# EAGLE schematic ESP-01_Slim (EAGLE 9.6.2)
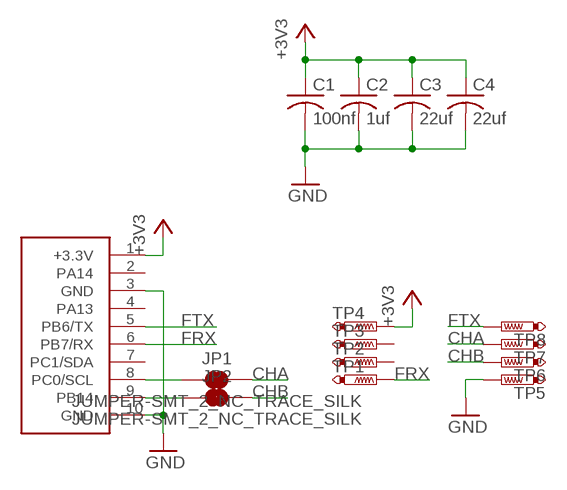
[diagram p0: schematic, sheet 1]

## Parts
C1  100nf  C-USC0805  [C0805]
C2  1uf  C-USC0805  [C0805]
C3  22uf  C-USC3216  [C3216]
C4  22uf  C-USC3216  [C3216]
JP1  JUMPER-SMT_2_NC_TRACE_SILK  [SMT-JUMPER_2_NC_TRACE_SILK]
JP2  JUMPER-SMT_2_NC_TRACE_SILK  [SMT-JUMPER_2_NC_TRACE_SILK]
TP1  PTR1B1,27  [B1,27]
TP2  PTR1B1,27  [B1,27]
TP3  PTR1B1,27  [B1,27]
TP4  PTR1B1,27  [B1,27]
TP5  PTR1B1,27  [B1,27]
TP6  PTR1B1,27  [B1,27]
TP7  PTR1B1,27  [B1,27]
TP8  PTR1B1,27  [B1,27]
U$2  RIGHT-H2-SMD  [RIGHT-H2-SMD]

## Nets
+3V3: C1.1 C2.1 C3.1 C4.1 TP4.TP U$2.1(+3.3V)
CHA: JP1.2 TP7.TP
CHB: JP2.2 TP6.TP
FRX: TP1.TP U$2.6(PB7/RX)
FTX: TP8.TP U$2.5(PB6/TX)
GND: C1.2 C2.2 C3.2 C4.2 TP5.TP U$2.3(GND) U$2.10(GND)
N$1: JP1.1 U$2.8(PC0/SCL)
N$4: JP2.1 U$2.9(PB14)
Unconnected: TP2.TP TP3.TP U$2.2(PA14) U$2.4(PA13) U$2.7(PC1/SDA)

## Library data of the parts
C1-C4 = rcl:C-US: CAPACITOR, American symbol; SPICEPREFIX: C
JP1 JP2 = SparkFun-Jumpers:JUMPER-SMT_2_NC_TRACE: Normally closed trace jumper This jumper has a trace between two pads so it's normally closed (NC). Use a razor knife to open the connection. For best results follow the IPC guidelines for cutting traces: Cutout at least 0.063 mm (0.005 in). Remove all loose material to clean up the cut area. Seal the cut with an approved epoxy. Reapply solder to reclose the connection.
TP1-TP8 = testpad:PTR1: TEST PIN
U$2 = Flipper-Zero-GPIO-Headers:RIGHT-H2-SMD